# EAGLE board MARK-II board (EAGLE 8.5.0), part 1 of 2
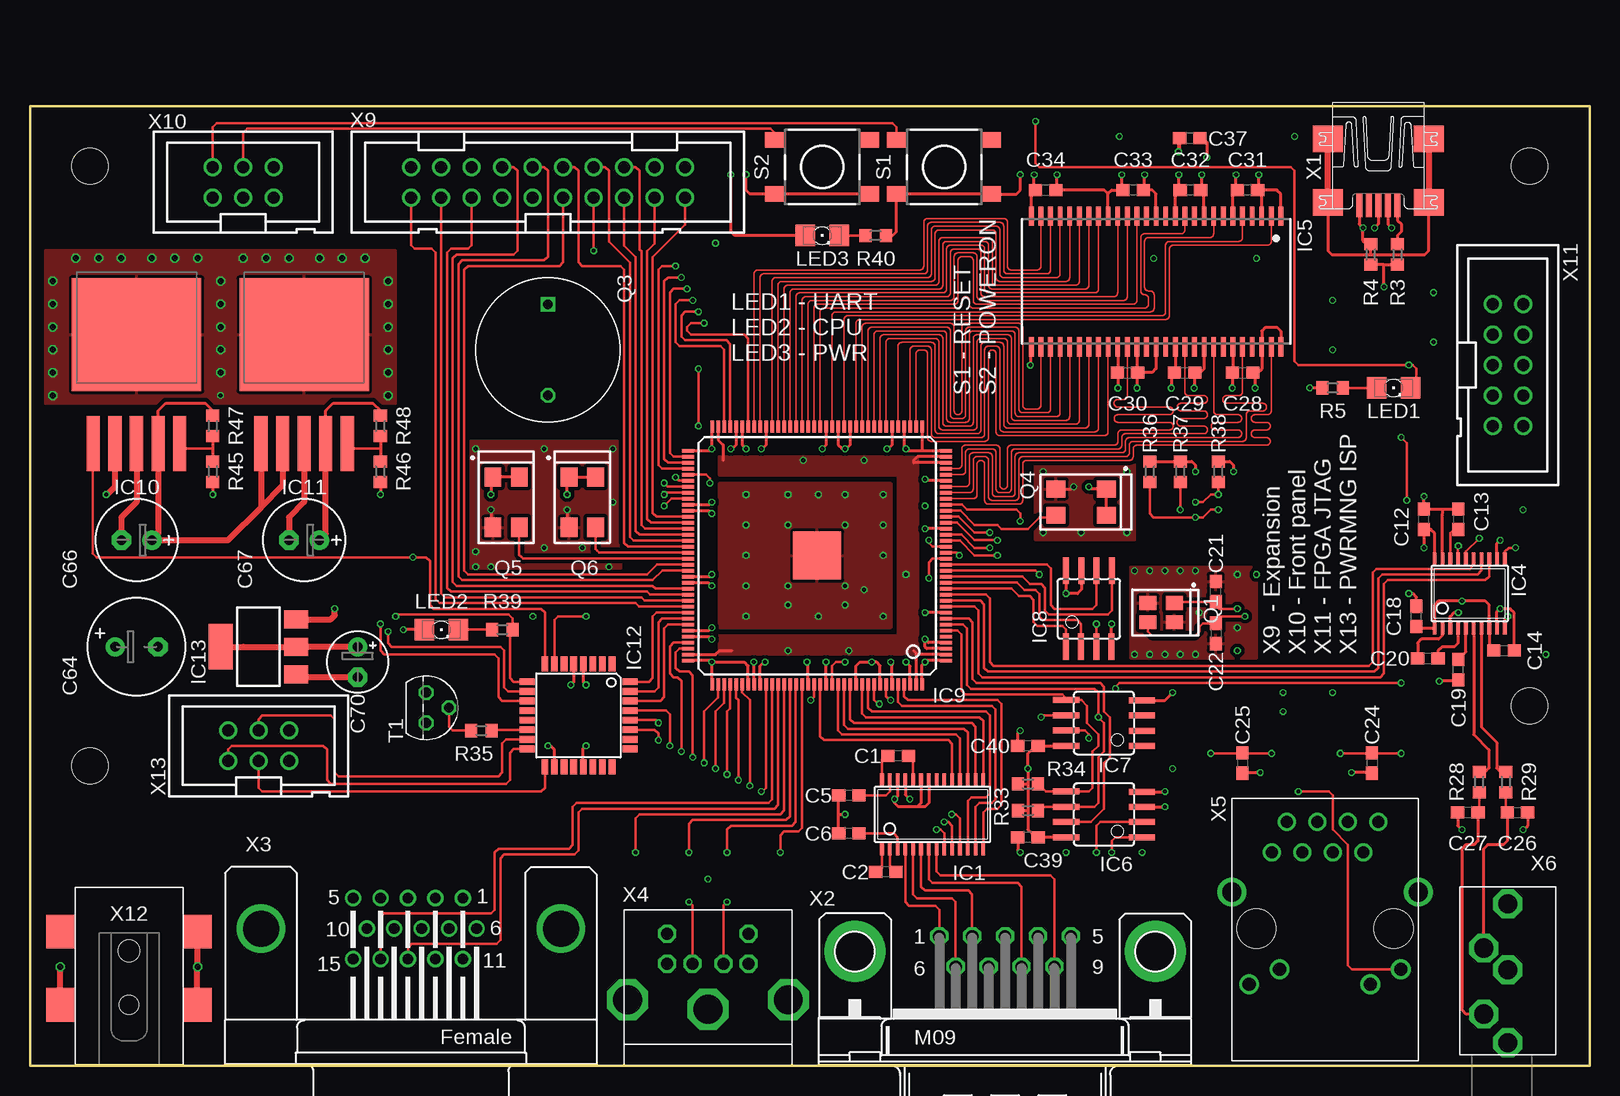
[diagram p6: board, top side]
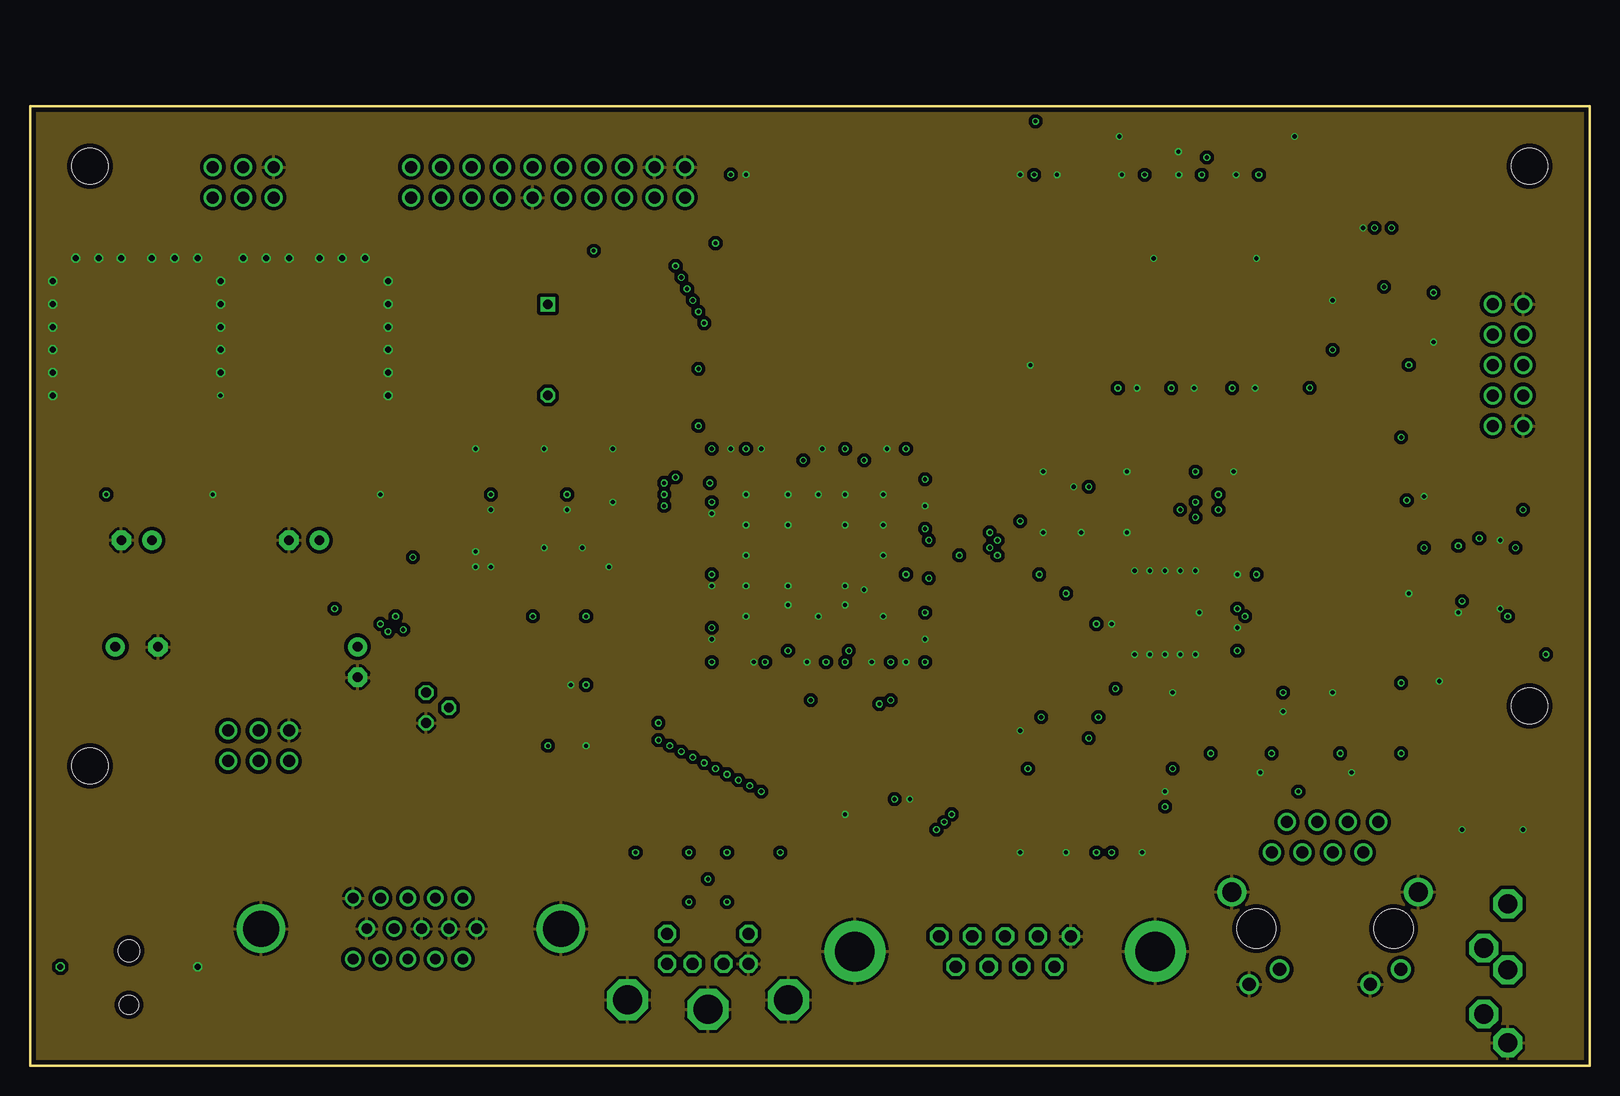
[diagram p7: board, inner layer Route2]
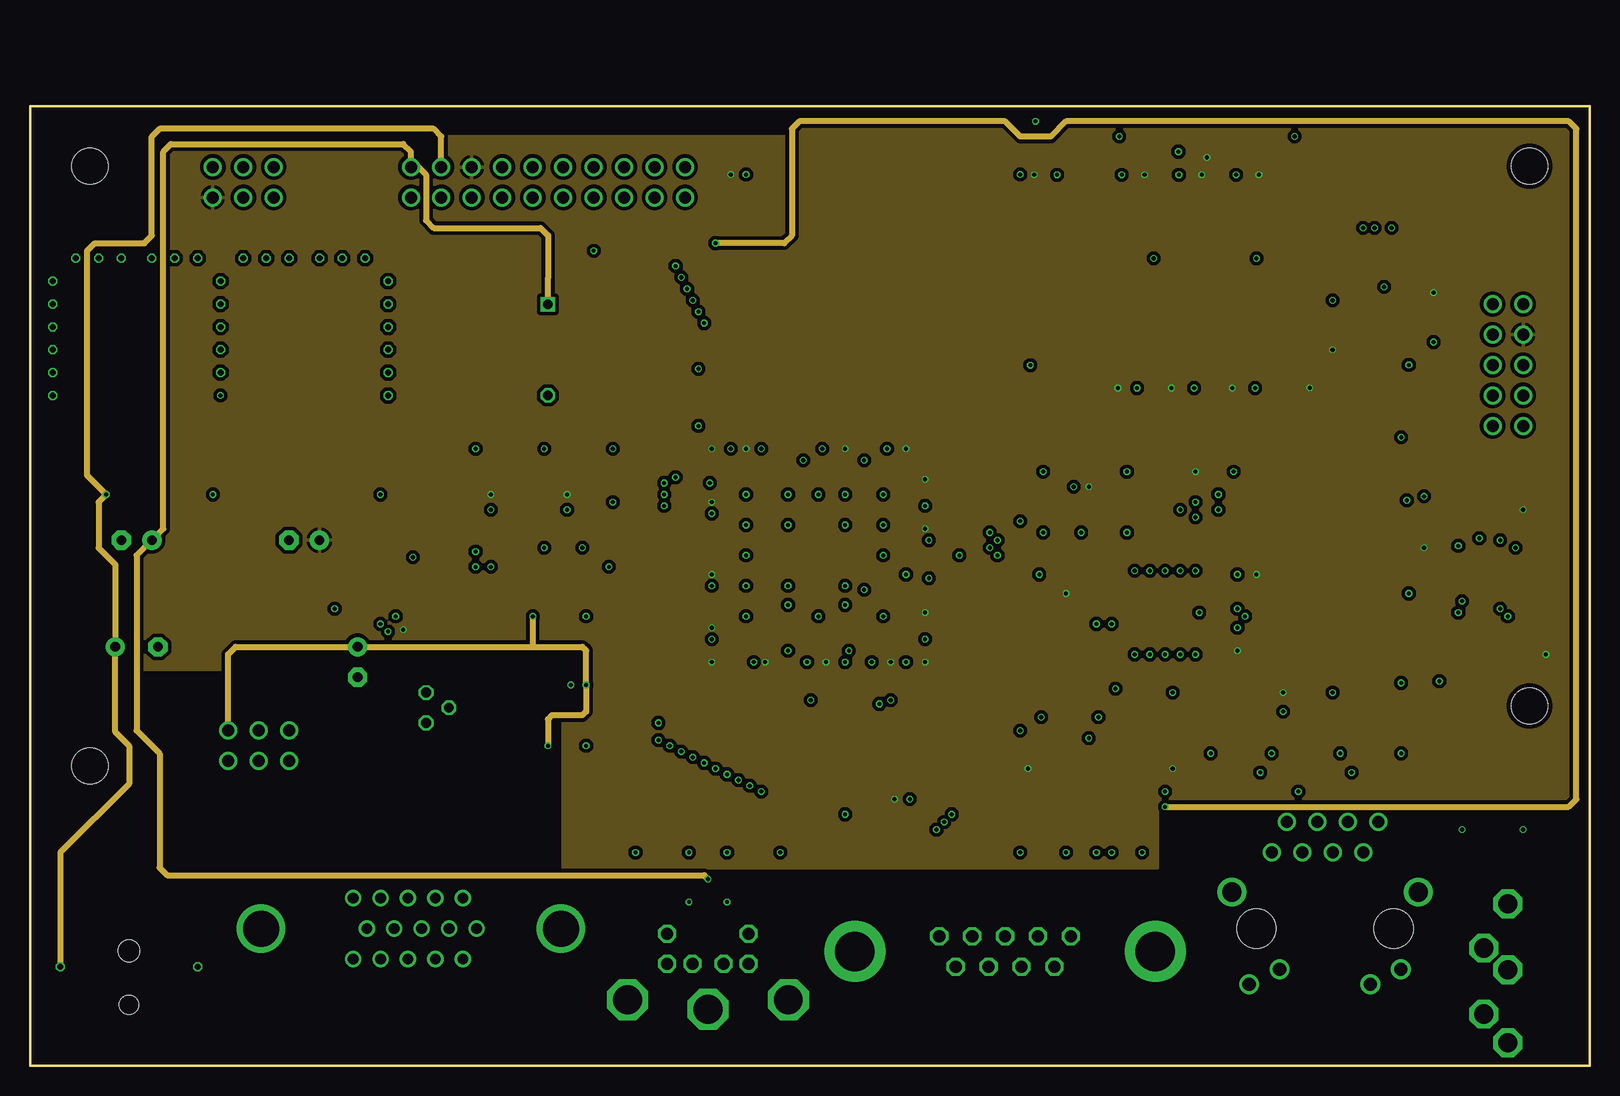
[diagram p8: board, inner layer Route15]
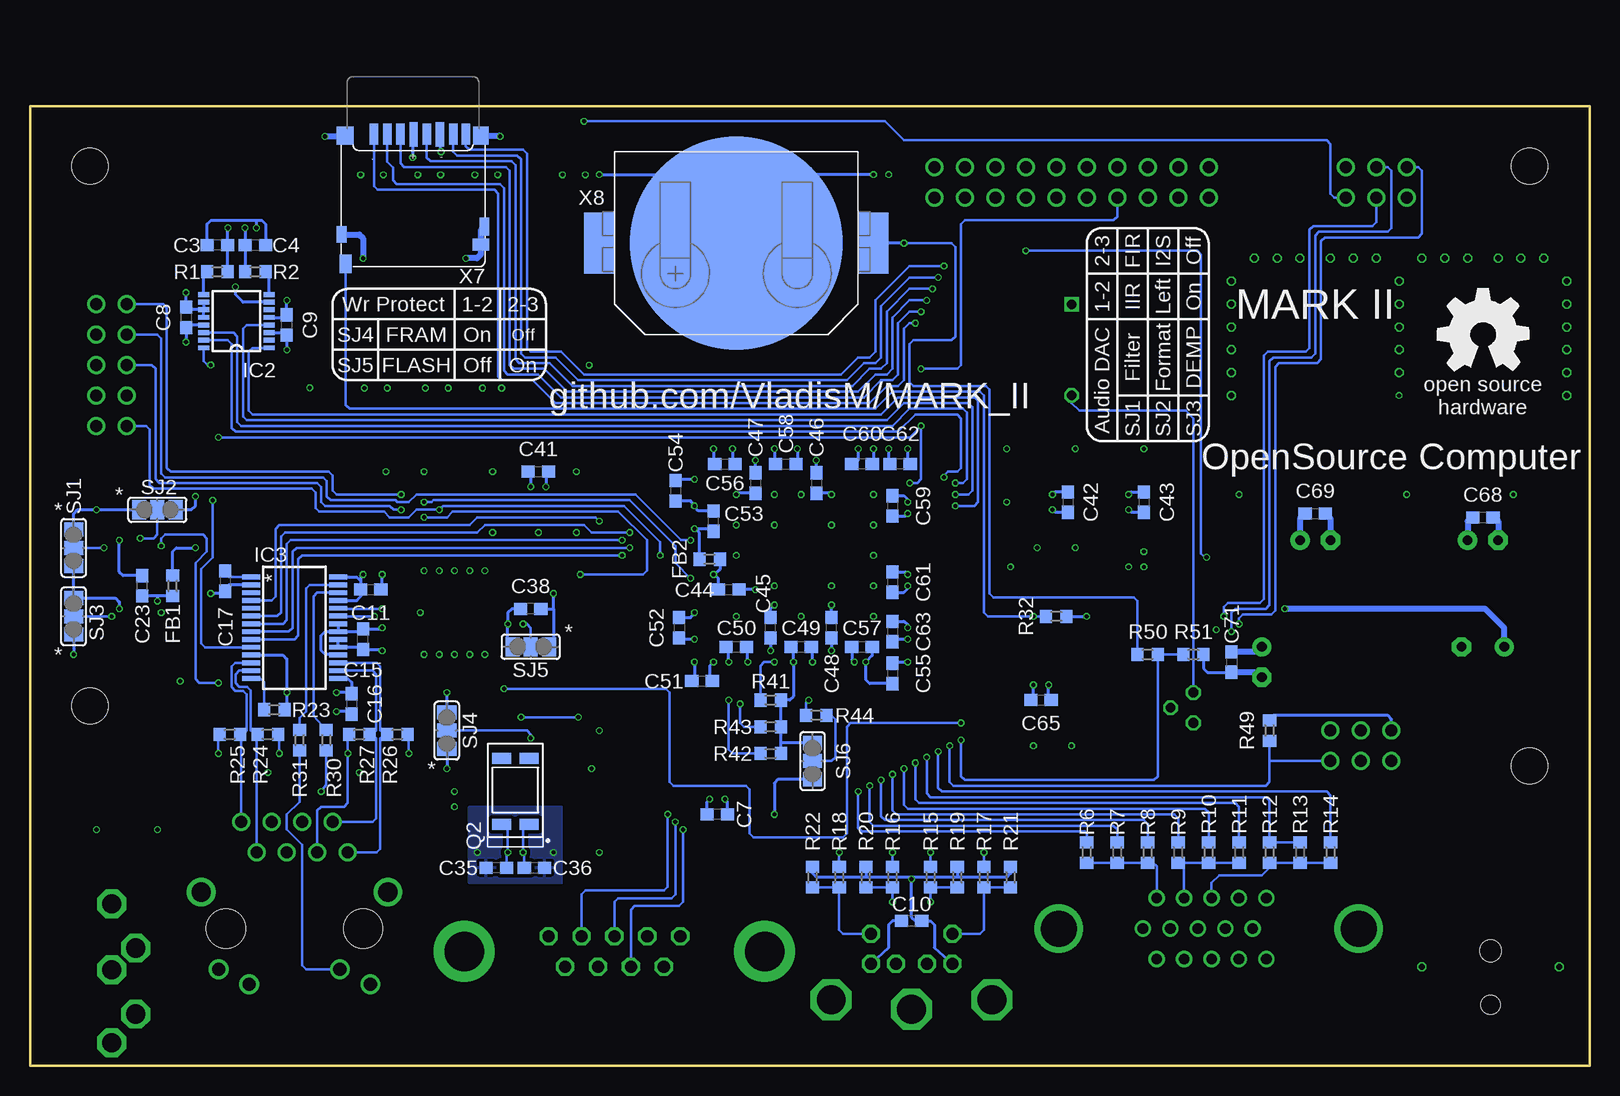
[diagram p9: board, bottom side, seen from below]

Size 130 x 80 mm. Coordinates in mm from the lower left corner, seen from the top.
Outline: 130,0 119.36,0
Outline: 130,0 130,80 0,80 0,0 130,0
Copper layers (1*2*15*16): Top 0.035559375mm / dielectric 0.17018125mm / Route2 0.01778125mm / dielectric 47mil / Route15 0.01778125mm / dielectric 0.17018125mm / Bottom 0.035559375mm
Design rules "OSHPark-4layer": minimum track width 5mil, minimum drill 10mil, track to track 5mil, track to pad 5mil, pad to pad 5mil, via to via 5mil, smd to smd 5mil, copper to edge 15mil, drill to drill 6mil, minimum pad ring 4mil, minimum via ring 4mil, stop-mask expansion 2.5mil, vias tented up to drill 0mil, thermal gap 10mil
Net classes: 1 power: width 0.254 mm, drill 0.35 mm; 2 signal: width 0.203 mm, drill 0.35 mm; 3 sdram: width 0.127 mm, drill 0.35 mm; 4 vbat: width 0.203 mm, drill 0.35 mm
Holes 3 mm at 125,75 125,30 5,75 5,25
tRestrict: area 122,27 to 128,33; area 122,72 to 128,78; area 2,72 to 8,78; area 2,22 to 8,28
bRestrict: area 2,22 to 8,28; area 2,72 to 8,78; area 122,72 to 128,78; area 122,27 to 128,33
vRestrict: area 2,72 to 8,78; area 2,22 to 8,28; area 122,27 to 128,33; area 122,72 to 128,78

## Footprints (pad centres in the part's own frame; a part is rotated, then mirrored left to right if it is on the bottom)
C0603 = smd 1.1 x 1: 1 -0.85,0; 2 0.85,0
E3,5-8 = drill 0.813 pad 1.6: + -1.778,0 | drill 0.813 pad 1.6 octagon: - 1.778,0
E2,5-7 = drill 0.813 pad 1.6: + -1.27,0 | drill 0.813 pad 1.6 octagon: - 1.27,0
E2,5-5 = drill 0.813 pad 1.6: + -1.27,0 | drill 0.813 pad 1.6 octagon: - 1.27,0
R0603 = smd 1 x 1.1: 1 -0.85,0; 2 0.85,0
TSSOP28 = smd 0.305 x 0.991: 1 -4.225,-2.918; 2 -3.575,-2.918; 3 -2.925,-2.918; 4 -2.275,-2.918; 5 -1.625,-2.918; 6 -0.975,-2.918; 7 -0.325,-2.918; 8 0.325,-2.918; 9 0.975,-2.918; 10 1.625,-2.918; 11 2.275,-2.918; 12 2.925,-2.918; 13 3.575,-2.918; 14 4.225,-2.918; 15 4.225,2.918; 16 3.575,2.918; 17 2.925,2.918; 18 2.275,2.918; 19 1.625,2.918; 20 0.975,2.918; 21 0.325,2.918; 22 -0.325,2.918; 23 -0.975,2.918; 24 -1.625,2.918; 25 -2.275,2.918; 26 -2.925,2.918; 27 -3.575,2.918; 28 -4.225,2.918
SSOP16 = smd 0.914 x 0.406: 1 -2.718,2.223; 2 -2.718,1.587; 3 -2.718,0.953; 4 -2.718,0.318; 5 -2.718,-0.318; 6 -2.718,-0.953; 7 -2.718,-1.587; 8 -2.718,-2.223; 9 2.718,-2.223; 10 2.718,-1.587; 11 2.718,-0.953; 12 2.718,-0.318; 13 2.718,0.318; 14 2.718,0.953; 15 2.718,1.587; 16 2.718,2.223
SSOP28 = smd 0.4 x 1.5: 1 -4.225,-3.625; 2 -3.575,-3.625; 3 -2.925,-3.625; 4 -2.275,-3.625; 5 -1.625,-3.625; 6 -0.975,-3.625; 7 -0.325,-3.625; 8 0.325,-3.625; 9 0.975,-3.625; 10 1.625,-3.625; 11 2.275,-3.625; 12 2.925,-3.625; 13 3.575,-3.625; 14 4.225,-3.625; 15 4.225,3.625; 16 3.575,3.625; 17 2.925,3.625; 18 2.275,3.625; 19 1.625,3.625; 20 0.975,3.625; 21 0.325,3.625; 22 -0.325,3.625; 23 -0.975,3.625; 24 -1.625,3.625; 25 -2.275,3.625; 26 -2.925,3.625; 27 -3.575,3.625; 28 -4.225,3.625
TSSOP20 = smd 0.305 x 0.991: 1 -2.925,-2.918; 2 -2.275,-2.918; 3 -1.625,-2.918; 4 -0.975,-2.918; 5 -0.325,-2.918; 6 0.325,-2.918; 7 0.975,-2.918; 8 1.625,-2.918; 9 2.275,-2.918; 10 2.925,-2.918; 11 2.925,2.918; 12 2.275,2.918; 13 1.625,2.918; 14 0.975,2.918; 15 0.325,2.918; 16 -0.325,2.918; 17 -0.975,2.918; 18 -1.625,2.918; 19 -2.275,2.918; 20 -2.925,2.918
TSOP54 = smd 0.4 x 1.6: 1 -10.4,-5.45; 2 -9.6,-5.45; 3 -8.8,-5.45; 4 -8,-5.45; 5 -7.2,-5.45; 6 -6.4,-5.45; 7 -5.6,-5.45; 8 -4.8,-5.45; 9 -4,-5.45; 10 -3.2,-5.45; 11 -2.4,-5.45; 12 -1.6,-5.45; 13 -0.8,-5.45; 14 0,-5.45; 15 0.8,-5.45; 16 1.6,-5.45; 17 2.4,-5.45; 18 3.2,-5.45; 19 4,-5.45; 20 4.8,-5.45; 21 5.6,-5.45; 22 6.4,-5.45; 23 7.2,-5.45; 24 8,-5.45; 25 8.8,-5.45; 26 9.6,-5.45; 27 10.4,-5.45; 28 10.4,5.45; 29 9.6,5.45; 30 8.8,5.45; 31 8,5.45; 32 7.2,5.45; 33 6.4,5.45; 34 5.6,5.45; 35 4.8,5.45; 36 4,5.45; 37 3.2,5.45; 38 2.4,5.45; 39 1.6,5.45; 40 0.8,5.45; 41 0,5.45; 42 -0.8,5.45; 43 -1.6,5.45; 44 -2.4,5.45; 45 -3.2,5.45; 46 -4,5.45; 47 -4.8,5.45; 48 -5.6,5.45; 49 -6.4,5.45; 50 -7.2,5.45; 51 -8,5.45; 52 -8.8,5.45; 53 -9.6,5.45; 54 -10.4,5.45
SOIC8 = smd 0.5 x 2.2: 1 -1.905,-3.154; 2 -0.645,-3.154; 3 0.625,-3.154; 4 1.895,-3.154; 5 1.905,3.154; 6 0.635,3.154; 7 -0.635,3.154; 8 -1.905,3.154
EQFP144 = smd 1 x 0.3: 1 -10.75,8.75; 2 -10.75,8.25; 3 -10.75,7.75; 4 -10.75,7.25; 5 -10.75,6.75; 6 -10.75,6.25; 7 -10.75,5.75; 8 -10.75,5.25; 9 -10.75,4.75; 10 -10.75,4.25; 11 -10.75,3.75; 12 -10.75,3.25; 13 -10.75,2.75; 14 -10.75,2.25; 15 -10.75,1.75; 16 -10.75,1.25; 17 -10.75,0.75; 18 -10.75,0.25; 19 -10.75,-0.25; 20 -10.75,-0.75; 21 -10.75,-1.25; 22 -10.75,-1.75; 23 -10.75,-2.25; 24 -10.75,-2.75; 25 -10.75,-3.25; 26 -10.75,-3.75; 27 -10.75,-4.25; 28 -10.75,-4.75; 29 -10.75,-5.25; 30 -10.75,-5.75; 31 -10.75,-6.25; 32 -10.75,-6.75; 33 -10.75,-7.25; 34 -10.75,-7.75; 35 -10.75,-8.25; 36 -10.75,-8.75; 73 10.75,-8.75; 74 10.75,-8.25; 75 10.75,-7.75; 76 10.75,-7.25; 77 10.75,-6.75; 78 10.75,-6.25; 79 10.75,-5.75; 80 10.75,-5.25; 81 10.75,-4.75; 82 10.75,-4.25; 83 10.75,-3.75; 84 10.75,-3.25; 85 10.75,-2.75; 86 10.75,-2.25; 87 10.75,-1.75; 88 10.75,-1.25; 89 10.75,-0.75; 90 10.75,-0.25; 91 10.75,0.25; 92 10.75,0.75; 93 10.75,1.25; 94 10.75,1.75; 95 10.75,2.25; 96 10.75,2.75; 97 10.75,3.25; 98 10.75,3.75; 99 10.75,4.25; 100 10.75,4.75; 101 10.75,5.25; 102 10.75,5.75; 103 10.75,6.25; 104 10.75,6.75; 105 10.75,7.25; 106 10.75,7.75; 107 10.75,8.25; 108 10.75,8.75 | smd 0.3 x 1: 37 -8.75,-10.75; 38 -8.25,-10.75; 39 -7.75,-10.75; 40 -7.25,-10.75; 41 -6.75,-10.75; 42 -6.25,-10.75; 43 -5.75,-10.75; 44 -5.25,-10.75; 45 -4.75,-10.75; 46 -4.25,-10.75; 47 -3.75,-10.75; 48 -3.25,-10.75; 49 -2.75,-10.75; 50 -2.25,-10.75; 51 -1.75,-10.75; 52 -1.25,-10.75; 53 -0.75,-10.75; 54 -0.25,-10.75; 55 0.25,-10.75; 56 0.75,-10.75; 57 1.25,-10.75; 58 1.75,-10.75; 59 2.25,-10.75; 60 2.75,-10.75; 61 3.25,-10.75; 62 3.75,-10.75; 63 4.25,-10.75; 64 4.75,-10.75; 65 5.25,-10.75; 66 5.75,-10.75; 67 6.25,-10.75; 68 6.75,-10.75; 69 7.25,-10.75; 70 7.75,-10.75; 71 8.25,-10.75; 72 8.75,-10.75; 109 8.75,10.75; 110 8.25,10.75; 111 7.75,10.75; 112 7.25,10.75; 113 6.75,10.75; 114 6.25,10.75; 115 5.75,10.75; 116 5.25,10.75; 117 4.75,10.75; 118 4.25,10.75; 119 3.75,10.75; 120 3.25,10.75; 121 2.75,10.75; 122 2.25,10.75; 123 1.75,10.75; 124 1.25,10.75; 125 0.75,10.75; 126 0.25,10.75; 127 -0.25,10.75; 128 -0.75,10.75; 129 -1.25,10.75; 130 -1.75,10.75; 131 -2.25,10.75; 132 -2.75,10.75; 133 -3.25,10.75; 134 -3.75,10.75; 135 -4.25,10.75; 136 -4.75,10.75; 137 -5.25,10.75; 138 -5.75,10.75; 139 -6.25,10.75; 140 -6.75,10.75; 141 -7.25,10.75; 142 -7.75,10.75; 143 -8.25,10.75; 144 -8.75,10.75 | smd 4 x 4: E 0,0
D2PAK-5 = smd 1.1 x 4.6: 1 -3.61,-5.28; 2 -1.81,-5.28; 3 -0.01,-5.28; 4 1.79,-5.28; 5 3.59,-5.28 | smd 10.8 x 9.4: P 0,3.81
TQFP32-08 = smd 1.27 x 0.559: 1 -4.293,2.8; 2 -4.293,2; 3 -4.293,1.2; 4 -4.293,0.4; 5 -4.293,-0.4; 6 -4.293,-1.2; 7 -4.293,-2; 8 -4.293,-2.8; 17 4.293,-2.8; 18 4.293,-2; 19 4.293,-1.2; 20 4.293,-0.4; 21 4.293,0.4; 22 4.293,1.2; 23 4.293,2; 24 4.293,2.8 | smd 0.559 x 1.27: 9 -2.8,-4.293; 10 -2,-4.293; 11 -1.2,-4.293; 12 -0.4,-4.293; 13 0.4,-4.293; 14 1.2,-4.293; 15 2,-4.293; 16 2.8,-4.293; 25 2.8,4.293; 26 2,4.293; 27 1.2,4.293; 28 0.4,4.293; 29 -0.4,4.293; 30 -1.2,4.293; 31 -2,4.293; 32 -2.8,4.293
SOT223 = smd 1.5 x 2: 1 -2.3,-3.15; 2 0,-3.15; 3 2.3,-3.15 | smd 3.8 x 2: 4 0,3.15
1206 = smd 1.6 x 1.803: A -1.422,0; C 1.422,0
3.4X2.7-4-PAD = smd 1.4 x 1.15: 1 -1.1,-0.8; 2 1.1,-0.8; 3 1.1,0.8; 4 -1.1,0.8
85SMX = smd 0.9 x 1.6: 1 -2.75,-1.15; 2 2.75,-1.15; 3 2.75,1.15; 4 -2.75,1.15
BUUZZER = drill 0.8 octagon: N 3.8,0 | drill 0.8 square: P -3.8,0
5.2X3.4-4-PAD = smd 1.6 x 1.4: 1 -2.1,-1.1; 2 2.1,-1.1; 3 2.1,1.1; 4 -2.1,1.1
DTSM-6 = smd 1.55 x 1.3: 1 -3.975,2.25; 2 3.975,2.25; 3 -3.975,-2.25; 4 3.975,-2.25
SJ_2 = smd 1.168 x 1.6: 1 -1.524,0; 2 0,0; 3 1.524,0
TO92 = drill 0.813 octagon: 1 1.27,0; 2 0,1.905; 3 -1.27,0
UX60A-MB-5ST = smd 2 x 0.5: 1 2.25,1.6; 2 2.25,0.8; 3 2.25,0; 4 2.25,-0.8; 5 2.25,-1.6 | smd 2.2 x 2.5: M1 -3.3,-4.2; M2 -3.3,4.2; M3 2,4.2; M4 2,-4.2
M09HP = drill 1.016 octagon: 1 -5.486,1.27; 2 -2.743,1.27; 3 0,1.27; 4 2.743,1.27; 5 5.486,1.27; 6 -4.115,-1.27; 7 -1.372,-1.27; 8 1.372,-1.27; 9 4.115,-1.27 | drill 3.302 pad 5.08: G1 -12.522,0; G2 12.522,0
HDF15H = drill 0.9: 1 4.329,2.54; 2 2.043,2.54; 3 -0.243,2.54; 4 -2.529,2.54; 5 -4.815,2.54; 6 5.472,0; 7 3.186,0; 8 0.9,0; 9 -1.386,0; 10 -3.672,0; 11 4.329,-2.54; 12 2.043,-2.54; 13 -0.243,-2.54; 14 -2.529,-2.54; 15 -4.815,-2.54 | drill 3: SCH1 -12.5,0; SCH2 12.5,0
MINIDIN_6_3GND = drill 1 octagon: 1 -1.3,-8.5; 2 1.3,-8.5; 3 -3.4,-8.5; 4 3.4,-8.5; 5 -3.4,-11; 6 3.4,-11 | drill 2.4 octagon: CASE1 -6.7,-5.5; CASE2 6.7,-5.5; SHIELDING 0,-4.7
RB1-125BAG1A = drill 1: 1 -4.445,7.62; 2 -3.175,10.16; 3 -1.905,7.62; 4 -0.635,10.16; 5 0.635,7.62; 6 1.905,10.16; 7 3.175,7.62; 8 4.445,10.16 | drill 1.6: GND1 -7.775,4.32; GND2 7.775,4.32 | drill 1.1: LEDG_A -3.785,-2.11; LEDG_K -6.325,-3.36; LEDY_A 6.325,-2.11; LEDY_K 3.785,-3.36 | hole 3.25: -5.715,1.27; 5.715,1.27
JACK = drill 1.6 octagon: 1 0,0; 2 2.4,2; 3 7.9,2; 4 11.6,0; 5 6.1,0
DM3D = smd 0.7 x 1.75: CD/DAT3 8.15,0.45; CLK 4.85,0.45; CMD 7.05,0.45; DAT0 2.65,0.45; DAT1 1.6,0.45; DAT2 9.25,0.45 | smd 0.8 x 1.5: GND1 0.05,8.15 | smd 0.8 x 1.4: GND2 11.95,8.8 | smd 1.4 x 1.5: GND3 11.65,0.55 | smd 1.3 x 1.5: GND4 0.35,0.55 | smd 1 x 1.55: SW_A 11.6,11.25 | smd 1.4 x 1: SW_B 0.35,9.65 | smd 0.7 x 2.032: VDD 5.95,0.45; VSS 3.75,0.45
BAT-HLD-002-SMT = smd 17.78 x 17.78: N 0,0 | smd 2.54 x 5.08: P1 -11.43,0; P2 11.43,0
PAK100/2500-20 = drill 1 pad 1.422: 1 -11.43,-1.27; 2 -11.43,1.27; 3 -8.89,-1.27; 4 -8.89,1.27; 5 -6.35,-1.27; 6 -6.35,1.27; 7 -3.81,-1.27; 8 -3.81,1.27; 9 -1.27,-1.27; 10 -1.27,1.27; 11 1.27,-1.27; 12 1.27,1.27; 13 3.81,-1.27; 14 3.81,1.27; 15 6.35,-1.27; 16 6.35,1.27; 17 8.89,-1.27; 18 8.89,1.27; 19 11.43,-1.27; 20 11.43,1.27
PAK100/2300-06 = drill 1 pad 1.422: 1 -2.54,-1.27; 2 -2.54,1.27; 3 0,-1.27; 4 0,1.27; 5 2.54,-1.27; 6 2.54,1.27
PAK100/2500-10 = drill 1 pad 1.422: 1 -5.08,-1.27; 2 -5.08,1.27; 3 -2.54,-1.27; 4 -2.54,1.27; 5 0,-1.27; 6 0,1.27; 7 2.54,-1.27; 8 2.54,1.27; 9 5.08,-1.27; 10 5.08,1.27
PJ-002BH-SMT = smd 2.8 x 2.4: 1 0,5.7; 2 0,-5.7; 3 6.1,-5.7; 11 6.1,5.7 | hole 1.6: 0,0 | hole 1.8: 4.5,0

## Placement (x,y rotation side)
C1  100n  [C0603]  72.37,25.84 180 top
C2  100n  [C0603]  71.34,16.16 180 top
C3  47p  [C0603]  114.38,68.42 180 bottom
C4  47p  [C0603]  111.2,68.42 0 bottom
C5  100n  [C0603]  68.26,22.54 180 top
C6  100n  [C0603]  68.26,19.37 180 top
C7  100n  [C0603]  72.71,20.95 180 bottom
C8  100n  [C0603]  117,62.39 270 bottom
C9  100n  [C0603]  108.58,61.75 90 bottom
C10  100n  [C0603]  56.52,12.06 180 bottom
C11  100n  [C0603]  101.6,39.69 0 bottom
C12  100n  [C0603]  116.2,45.56 90 top
C13  100n  [C0603]  119.06,45.56 270 top
C14  100n  [C0603]  122.87,34.61 0 top
C15  100n  [C0603]  102.23,35.56 90 bottom
C16  100n  [C0603]  103.19,30.16 270 bottom
C17  10u  [C0603]  113.72,40.4 270 bottom
C18  100n  [C0603]  115.57,37.47 90 top
C19  2u2  [C0603]  119.06,33.02 90 top
C20  2u2  [C0603]  116.52,33.97 0 top
C21  10p  [C0603]  98.84,39.53 90 top
C22  10p  [C0603]  98.84,36.04 270 top
C23  100n  [C0603]  120.65,40.01 90 bottom
C24  100n  [C0603]  111.86,25.24 270 top
C25  100n  [C0603]  101.06,25.24 270 top
C26  2n2  [C0603]  123.98,21.11 0 top
C27  2n2  [C0603]  119.86,21.11 180 top
C28  100n  [C0603]  101.09,57.77 0 top
C29  100n  [C0603]  96.25,57.77 0 top
C30  100n  [C0603]  91.49,57.77 0 top
C31  100n  [C0603]  101.49,73.01 180 top
C32  100n  [C0603]  96.72,73.01 180 top
C33  100n  [C0603]  91.96,73.01 180 top
C34  100n  [C0603]  84.66,73.01 0 top
C35  12p  [C0603]  91.12,16.51 180 bottom
C36  12p  [C0603]  87.95,16.51 0 bottom
C37  100n  [C0603]  96.68,77.31 180 top
C38  100n  [C0603]  88.27,38.1 180 bottom
C39  100n  [C0603]  83.19,19.05 180 top
C40  100n  [C0603]  83.19,26.67 180 top
C41  100n  [C0603]  87.63,49.53 0 bottom
C42  100n  [C0603]  43.5,46.99 270 bottom
C43  100n  [C0603]  37.15,46.99 270 bottom
C44  100n  [C0603]  71.75,39.69 0 bottom
C45  100n  [C0603]  68.26,36.51 90 bottom
C46  100n  [C0603]  64.45,48.58 270 bottom
C47  100n  [C0603]  69.53,48.58 270 bottom
C48  100n  [C0603]  63.18,36.51 90 bottom
C49  100n  [C0603]  65.72,34.92 0 bottom
C50  100n  [C0603]  71.12,34.92 0 bottom
C51  100n  [C0603]  73.98,32.07 0 bottom
C52  100n  [C0603]  75.88,36.51 270 bottom
C53  100n  [C0603]  73.03,45.4 90 bottom
C54  100n  [C0603]  76.2,47.94 270 bottom
C55  100n  [C0603]  58.1,32.7 270 bottom
C56  100n  [C0603]  72.07,50.16 0 bottom
C57  100n  [C0603]  60.64,34.92 0 bottom
C58  100n  [C0603]  66.99,50.16 0 bottom
C59  100n  [C0603]  58.1,46.67 270 bottom
C60  100n  [C0603]  60.64,50.16 180 bottom
C61  100n  [C0603]  58.1,40.32 270 bottom
C62  100n  [C0603]  57.47,50.16 180 bottom
C63  100n  [C0603]  58.1,36.2 270 bottom
C64  470u  [E3,5-8]  8.89,34.92 0 top
C65  100n  [C0603]  45.72,30.48 0 bottom
C66  100u  [E2,5-7]  8.89,43.81 180 top
C67  100u  [E2,5-7]  22.86,43.81 180 top
C68  100n  [C0603]  8.89,45.72 0 bottom
C69  100n  [C0603]  22.86,46.04 0 bottom
C70  4u7  [E2,5-5]  27.3,33.66 270 top
C71  100n  [C0603]  29.84,33.66 270 bottom
FB1  BLM18AG601SN1D  [R0603]  118.11,40.01 270 bottom
FB2  BLM18AG601SN1D  [R0603]  73.34,42.23 0 bottom
IC1  MAX3243CPWR  [TSSOP28]  75.25,20.95 0 top
IC2  FT230XS  [SSOP16]  112.79,62.07 180 bottom
IC3  ENC28J60SS  [SSOP28]  107.95,36.51 270 bottom
IC4  PCM5100  [TSSOP20]  120.02,39.37 0 top
IC5  AS4C32M8SA  [TSOP54]  93.87,65.39 180 top
IC6  MCP7940NSN  [SOIC8]  89.53,20.95 90 top
IC7  FM24CL16BG  [SOIC8]  89.53,28.57 90 top
IC8  AT25DN256SS  [SOIC8]  88.27,38.1 0 top
IC9  10M25SAE144  [EQFP144]  65.61,42.53 180 top
IC10  IFX1963TBV  [D2PAK-5]  8.89,57.15 0 top
IC11  IFX1963TBV  [D2PAK-5]  22.86,57.15 0 top
IC12  ATMEGA48PB-AU  [TQFP32-08]  45.72,29.21 270 top
IC13  LD1117S33  [SOT223]  19.05,34.92 90 top
LED1  APT3216EC  [1206]  113.67,56.52 0 top
LED2  APT3216EC  [1206]  34.29,36.35 0 top
LED3  APT3216EC  [1206]  66.04,69.22 0 top
LOGO1  [OSHW_8MM]  8.89,60.96 0 bottom
Q1  25MHz  [3.4X2.7-4-PAD]  94.3,37.78 180 top
Q2  32.768kHz  [85SMX]  89.53,22.86 90 bottom
Q3  CMI-1275C-050  [BUUZZER]  43.18,59.69 270 top
Q4  25MHz  [5.2X3.4-4-PAD]  87.63,46.99 180 top
Q5  18,432MHz  [5.2X3.4-4-PAD]  39.69,46.99 270 top
Q6  22.5792MHz  [5.2X3.4-4-PAD]  46.04,46.99 270 top
R1  27R  [R0603]  114.38,66.2 180 bottom
R2  27R  [R0603]  111.2,66.2 0 bottom
R3  4k7  [R0603]  113.98,67.63 90 top
R4  10k  [R0603]  111.76,67.63 270 top
R5  330  [R0603]  108.58,56.52 0 top
R6  470  [R0603]  41.91,17.78 270 bottom
R7  1k  [R0603]  39.37,17.78 270 bottom
R8  2k2  [R0603]  36.83,17.78 270 bottom
R9  470  [R0603]  34.29,17.78 270 bottom
R10  1k  [R0603]  31.75,17.78 270 bottom
R11  2k2  [R0603]  29.21,17.78 270 bottom
R12  820  [R0603]  26.67,17.78 270 bottom
R13  820  [R0603]  24.13,17.78 270 bottom
R14  820  [R0603]  21.59,17.78 270 bottom
R15  120  [R0603]  54.93,15.72 270 bottom
R16  120  [R0603]  58.1,15.72 270 bottom
R17  120  [R0603]  50.48,15.72 270 bottom
R18  120  [R0603]  62.55,15.72 270 bottom
R19  2k2  [R0603]  52.7,15.72 90 bottom
R20  2k2  [R0603]  60.33,15.72 90 bottom
R21  2k2  [R0603]  48.26,15.72 90 bottom
R22  2k2  [R0603]  64.77,15.72 90 bottom
R23  2k32 1%  [R0603]  109.64,29.68 0 bottom
R24  49.9 1%  [R0603]  110.17,27.62 180 bottom
R25  49.9 1%  [R0603]  113.35,27.62 0 bottom
R26  49.9 1%  [R0603]  99.38,27.62 180 bottom
R27  49.9 1%  [R0603]  102.55,27.62 0 bottom
R28  470  [R0603]  120.81,23.66 270 top
R29  470  [R0603]  123.03,23.66 270 top
R30  220  [R0603]  105.31,27.15 270 bottom
R31  220  [R0603]  107.53,27.15 270 bottom
R32  10k  [R0603]  44.45,37.47 0 bottom
R33  4k7  [R0603]  83.19,21.27 0 top
R34  4k7  [R0603]  83.19,23.5 0 top
R35  330  [R0603]  37.62,27.94 180 top
R36  10k  [R0603]  93.34,49.53 90 top
R37  10k  [R0603]  95.89,49.53 90 top
R38  1k  [R0603]  99.06,49.53 90 top
R39  1k  [R0603]  39.37,36.35 0 top
R40  1k  [R0603]  70.48,69.22 0 top
R41  10k  [R0603]  68.26,30.48 0 bottom
R42  10k  [R0603]  68.26,26.04 0 bottom
R43  10k  [R0603]  68.26,28.26 0 bottom
R44  10k  [R0603]  64.45,29.21 0 bottom
R45  1k5 %1  [R0603]  15.24,49.53 90 top
R46  3k6 1%  [R0603]  29.21,49.53 90 top
R47  4k7 1%  [R0603]  15.24,53.34 90 top
R48  6k2 1%  [R0603]  29.21,53.34 90 top
R49  10k  [R0603]  26.67,27.94 90 bottom
R50  10k  [R0603]  36.83,34.29 180 bottom
R51  10k  [R0603]  33.02,34.29 180 bottom
S1  DTSM-6  [DTSM-6]  76.2,74.93 0 top
S2  DTSM-6  [DTSM-6]  66.04,74.93 0 top
SJ1  FILTER  [SJ_2]  126.36,43.18 270 bottom
SJ2  FORMAT  [SJ_2]  119.38,46.35 0 bottom
SJ3  DEMP  [SJ_2]  126.36,37.47 90 bottom
SJ4  WP  [SJ_2]  95.25,27.94 90 bottom
SJ5  WP  [SJ_2]  88.27,34.92 180 bottom
SJ6  ConfSel  [SJ_2]  64.77,25.4 270 bottom
T1  BC337-16 A1  [TO92]  33.02,29.84 270 top
X1  MINI-USBUX60A-MB-5ST  [UX60A-MB-5ST]  112.39,73.98 270 top
X2  5504F1-09P-02A-03  [M09HP]  81.28,9.53 0 top
X3  L77HDE15SD1CH4R  [HDF15H]  31.75,11.43 0 top
X4  MD-60SM  [MINIDIN_6_3GND]  56.52,0 180 top
X5  RB1-125BAG1A  [RB1-125BAG1A]  107.95,10.16 0 top
X6  SJ1-3535NG  [JACK]  123.19,1.91 90 top
X7  MICROSD-HRS_DM3D  [DM3D]  92.08,78.11 180 bottom
X8  BAT-HLD-002-SMT  [BAT-HLD-002-SMT]  71.12,68.58 180 bottom
X9  T821-120A1S100  [PAK100/2500-20]  43.18,73.66 0 top
X10  T821-106A1S100  [PAK100/2300-06]  17.78,73.66 0 top
X11  T821-110A1S100  [PAK100/2500-10]  123.19,58.42 270 top
X12  PJ-002BH-SMT-TR  [PJ-002BH-SMT]  8.26,5.08 90 top
X13  T821-106A1S100  [PAK100/2300-06]  19.05,26.67 0 top